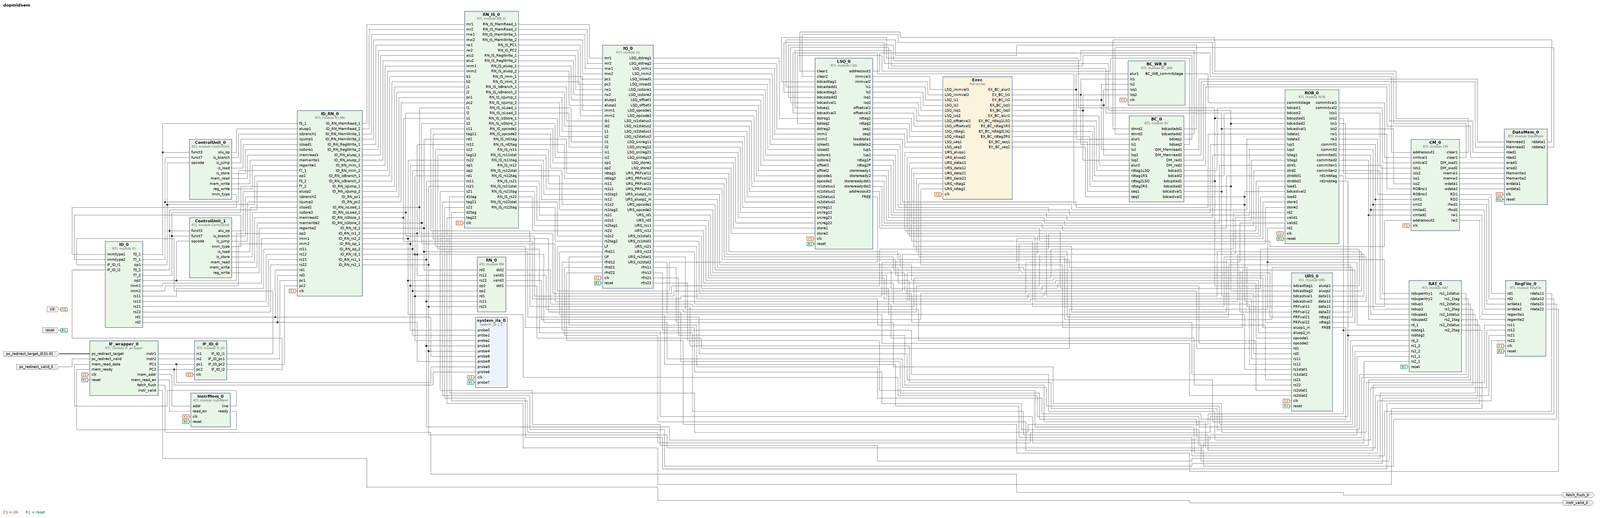
[diagram p0: block diagram of the top level, whole]
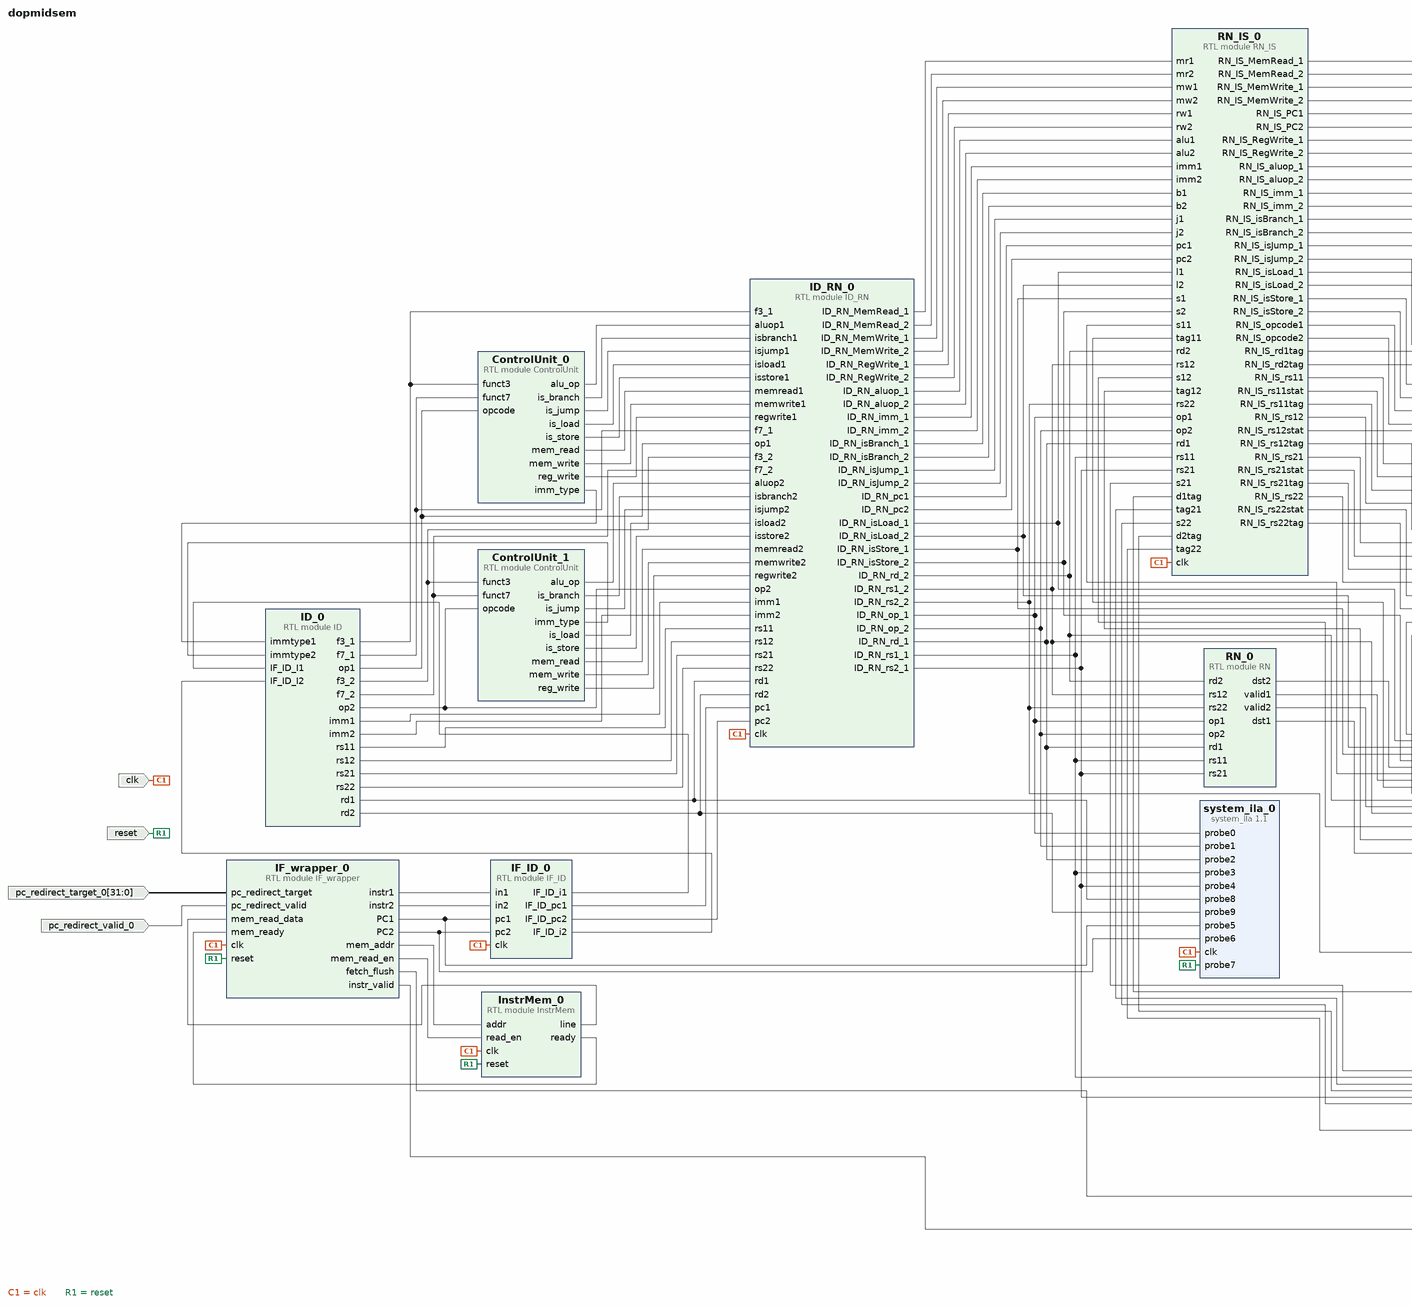
[diagram p1: block diagram of the top level, left part]
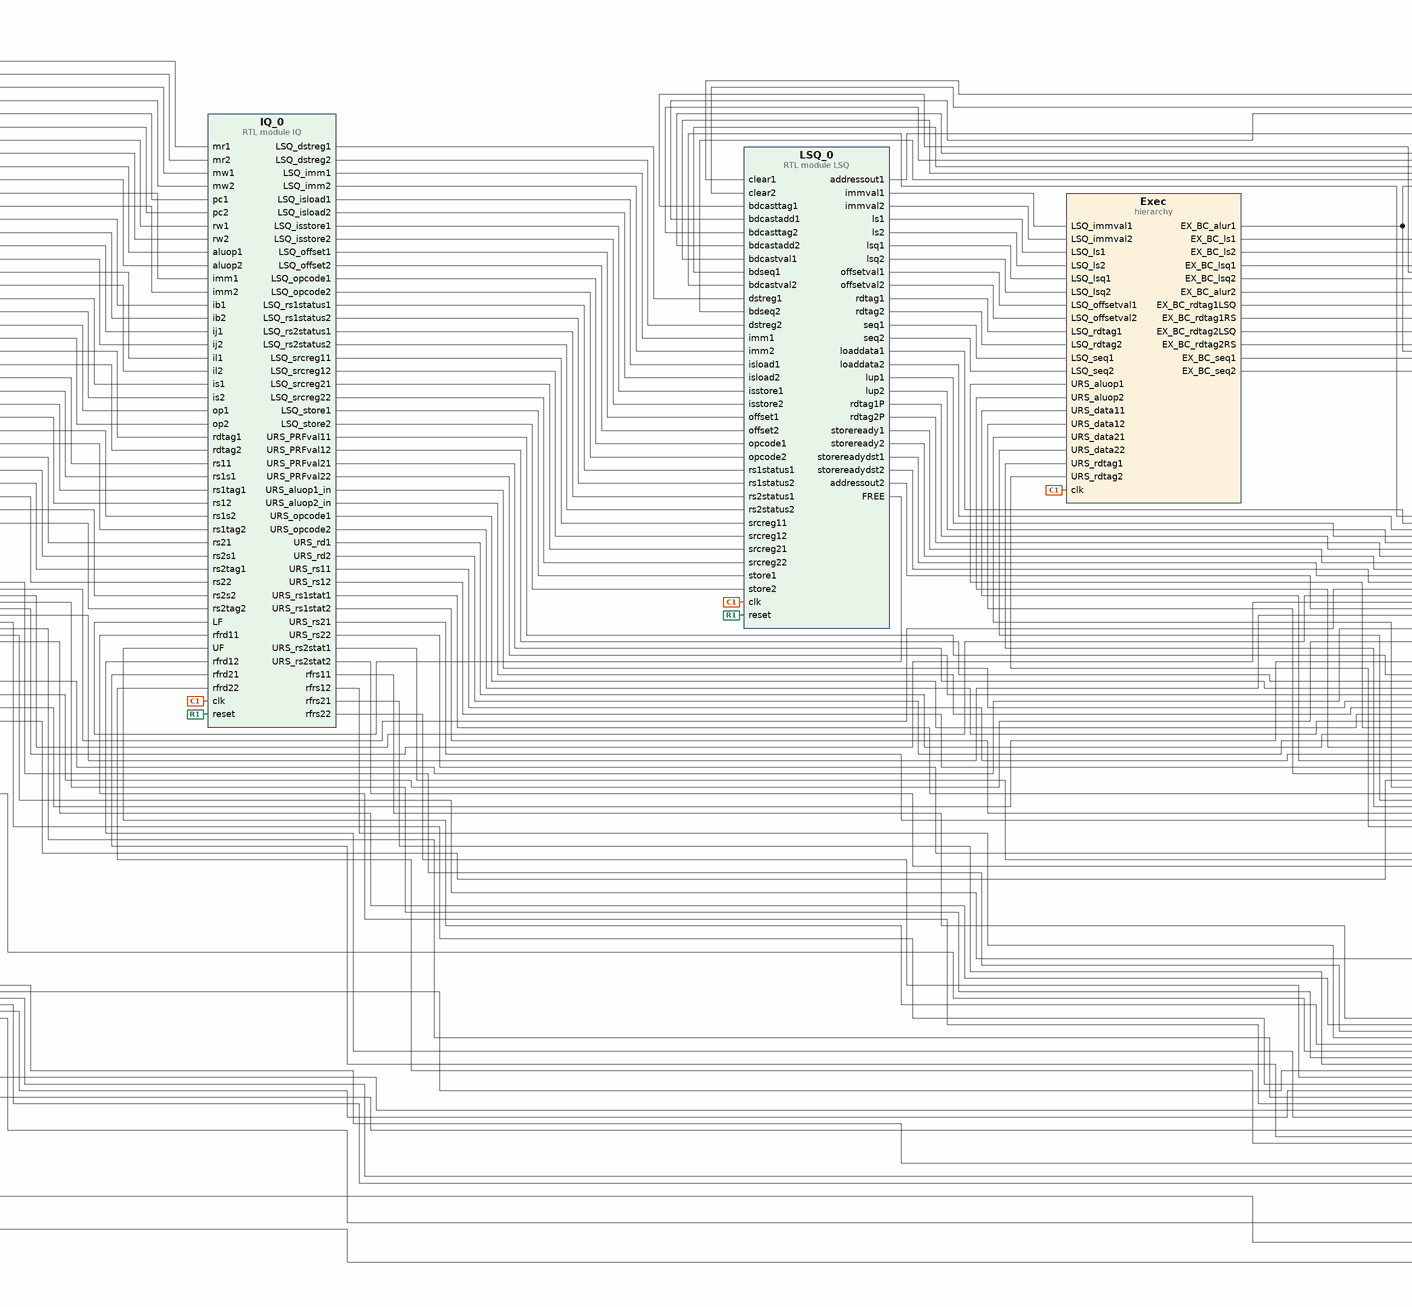
[diagram p2: block diagram of the top level, centre part]
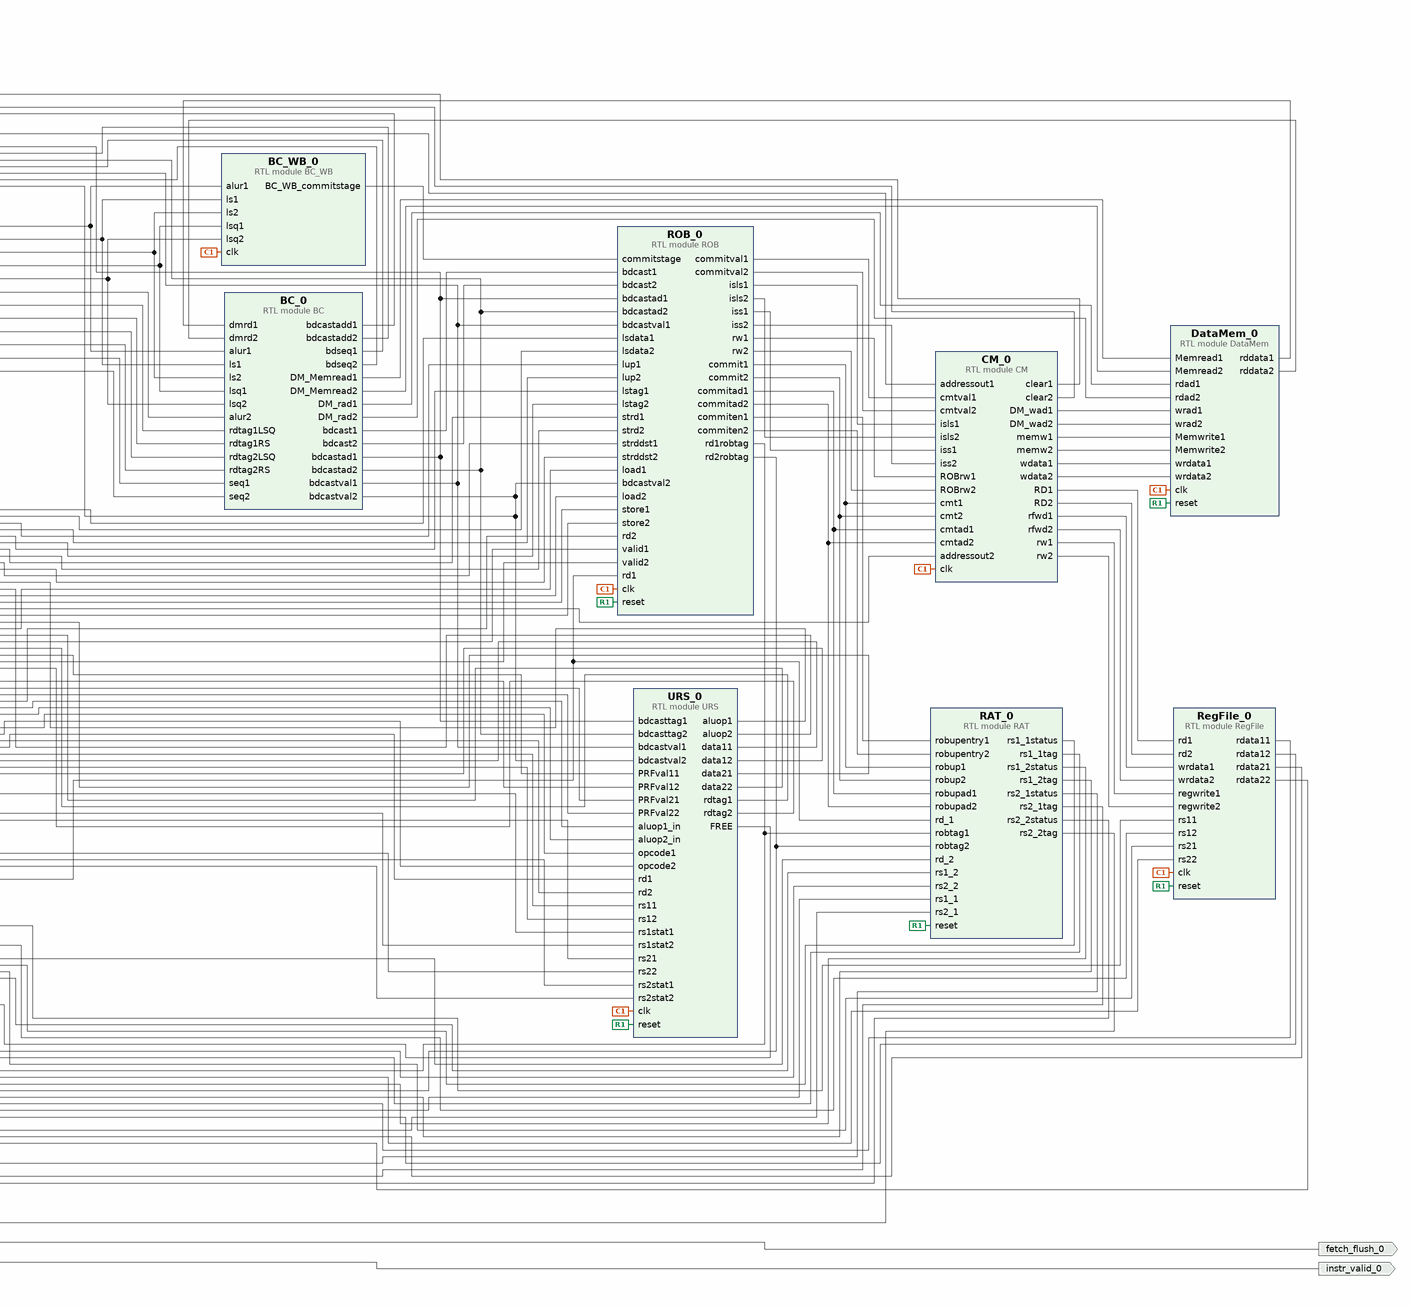
[diagram p3: block diagram of the top level, right part]
# Vivado block design dopmidsem, xc7z020clg484-1, Vivado 2025.1
create_bd_design dopmidsem

create_bd_port -dir I -type clk clk
set_property -dict {CONFIG.FREQ_HZ 100000000} [get_bd_ports clk]
create_bd_port -dir I -type rst reset
set_property -dict {CONFIG.POLARITY ACTIVE_HIGH} [get_bd_ports reset]
create_bd_port -dir O instr_valid_0
create_bd_port -dir O fetch_flush_0
create_bd_port -dir I -from 31 -to 0 pc_redirect_target_0
create_bd_port -dir I pc_redirect_valid_0

create_bd_cell -type module -reference IF_ID IF_ID_0
create_bd_cell -type module -reference ID ID_0
create_bd_cell -type module -reference ControlUnit ControlUnit_0
create_bd_cell -type module -reference ControlUnit ControlUnit_1
create_bd_cell -type module -reference ID_RN ID_RN_0
create_bd_cell -type module -reference ROB ROB_0
create_bd_cell -type module -reference RAT RAT_0
create_bd_cell -type module -reference RN RN_0
create_bd_cell -type module -reference RN_IS RN_IS_0
create_bd_cell -type module -reference IQ IQ_0
create_bd_cell -type module -reference RegFile RegFile_0
create_bd_cell -type module -reference URS URS_0
create_bd_cell -type module -reference LSQ LSQ_0
create_bd_cell -type module -reference BC BC_0
create_bd_cell -type module -reference DataMem DataMem_0
create_bd_cell -type module -reference BC_WB BC_WB_0
create_bd_cell -type module -reference CM CM_0
create_bd_cell -type hier Exec
create_bd_cell -type ip -vlnv xilinx.com:ip:system_ila:1.1 system_ila_0
set_property -dict [list \
  CONFIG.C_MON_TYPE NATIVE \
  CONFIG.C_NUM_OF_PROBES 10 \
  CONFIG.C_PROBE0_TYPE 0 \
  CONFIG.C_PROBE1_TYPE 0 \
  CONFIG.C_PROBE2_TYPE 0 \
  CONFIG.C_PROBE3_TYPE 0 \
  CONFIG.C_PROBE4_TYPE 0 \
  CONFIG.C_PROBE5_TYPE 0 \
  CONFIG.C_PROBE6_TYPE 0 \
] [get_bd_cells system_ila_0]
create_bd_cell -type module -reference IF_wrapper IF_wrapper_0
create_bd_cell -type module -reference InstrMem InstrMem_0

# ---- hierarchy /Exec ----
current_bd_instance /Exec
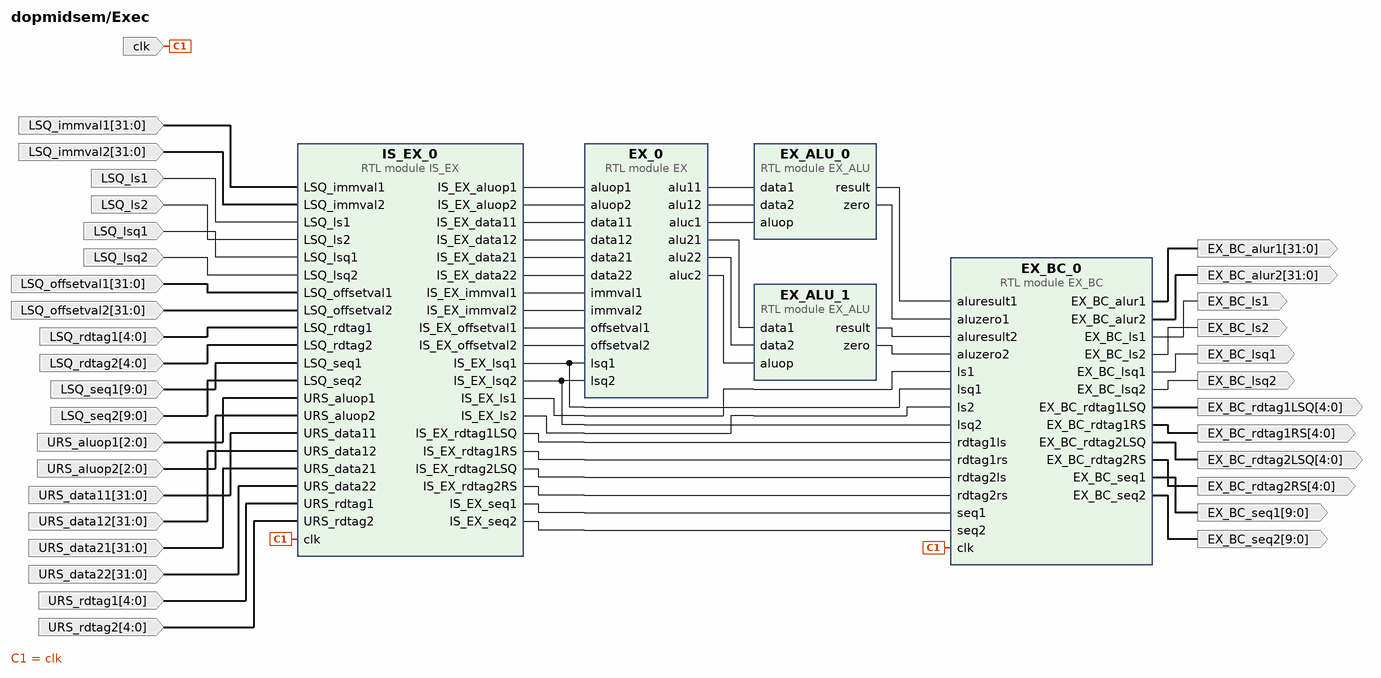
[diagram p4: block diagram inside /Exec]
create_bd_pin -dir I -type clk clk
create_bd_pin -dir O -from 31 -to 0 EX_BC_alur1
create_bd_pin -dir O -from 31 -to 0 EX_BC_alur2
create_bd_pin -dir O -from 4 -to 0 EX_BC_rdtag1LSQ
create_bd_pin -dir O -from 4 -to 0 EX_BC_rdtag2LSQ
create_bd_pin -dir O -from 9 -to 0 EX_BC_seq1
create_bd_pin -dir O -from 9 -to 0 EX_BC_seq2
create_bd_pin -dir O EX_BC_ls1
create_bd_pin -dir O EX_BC_ls2
create_bd_pin -dir O -from 4 -to 0 EX_BC_rdtag1RS
create_bd_pin -dir O -from 4 -to 0 EX_BC_rdtag2RS
create_bd_pin -dir O EX_BC_lsq1
create_bd_pin -dir O EX_BC_lsq2
create_bd_pin -dir I -from 4 -to 0 URS_rdtag2
create_bd_pin -dir I -from 2 -to 0 URS_aluop2
create_bd_pin -dir I -from 31 -to 0 URS_data21
create_bd_pin -dir I -from 4 -to 0 URS_rdtag1
create_bd_pin -dir I -from 2 -to 0 URS_aluop1
create_bd_pin -dir I -from 31 -to 0 URS_data12
create_bd_pin -dir I -from 31 -to 0 URS_data11
create_bd_pin -dir I -from 31 -to 0 URS_data22
create_bd_pin -dir I -from 4 -to 0 LSQ_rdtag1
create_bd_pin -dir I -from 31 -to 0 LSQ_immval2
create_bd_pin -dir I -from 4 -to 0 LSQ_rdtag2
create_bd_pin -dir I -from 9 -to 0 LSQ_seq1
create_bd_pin -dir I -from 31 -to 0 LSQ_offsetval1
create_bd_pin -dir I -from 9 -to 0 LSQ_seq2
create_bd_pin -dir I -from 31 -to 0 LSQ_immval1
create_bd_pin -dir I LSQ_ls2
create_bd_pin -dir I -from 31 -to 0 LSQ_offsetval2
create_bd_pin -dir I LSQ_lsq2
create_bd_pin -dir I LSQ_ls1
create_bd_pin -dir I LSQ_lsq1

create_bd_cell -type module -reference EX EX_0
create_bd_cell -type module -reference EX_ALU EX_ALU_0
create_bd_cell -type module -reference EX_ALU EX_ALU_1
create_bd_cell -type module -reference EX_BC EX_BC_0
create_bd_cell -type module -reference IS_EX IS_EX_0

# ---- connections ----

current_bd_instance /Exec
connect_bd_net [get_bd_pins EX_0/alu11] [get_bd_pins EX_ALU_0/data1]
connect_bd_net [get_bd_pins EX_0/alu12] [get_bd_pins EX_ALU_0/data2]
connect_bd_net [get_bd_pins EX_0/alu21] [get_bd_pins EX_ALU_1/data1]
connect_bd_net [get_bd_pins EX_0/alu22] [get_bd_pins EX_ALU_1/data2]
connect_bd_net [get_bd_pins EX_0/aluc1] [get_bd_pins EX_ALU_0/aluop]
connect_bd_net [get_bd_pins EX_0/aluc2] [get_bd_pins EX_ALU_1/aluop]
connect_bd_net [get_bd_pins EX_ALU_0/result] [get_bd_pins EX_BC_0/aluresult1]
connect_bd_net [get_bd_pins EX_ALU_0/zero] [get_bd_pins EX_BC_0/aluzero1]
connect_bd_net [get_bd_pins EX_ALU_1/result] [get_bd_pins EX_BC_0/aluresult2]
connect_bd_net [get_bd_pins EX_ALU_1/zero] [get_bd_pins EX_BC_0/aluzero2]
connect_bd_net [get_bd_pins EX_BC_0/EX_BC_alur1] [get_bd_pins EX_BC_alur1]
connect_bd_net [get_bd_pins EX_BC_0/EX_BC_alur2] [get_bd_pins EX_BC_alur2]
connect_bd_net [get_bd_pins EX_BC_0/EX_BC_ls1] [get_bd_pins EX_BC_ls1]
connect_bd_net [get_bd_pins EX_BC_0/EX_BC_ls2] [get_bd_pins EX_BC_ls2]
connect_bd_net [get_bd_pins EX_BC_0/EX_BC_lsq1] [get_bd_pins EX_BC_lsq1]
connect_bd_net [get_bd_pins EX_BC_0/EX_BC_lsq2] [get_bd_pins EX_BC_lsq2]
connect_bd_net [get_bd_pins EX_BC_0/EX_BC_rdtag1LSQ] [get_bd_pins EX_BC_rdtag1LSQ]
connect_bd_net [get_bd_pins EX_BC_0/EX_BC_rdtag1RS] [get_bd_pins EX_BC_rdtag1RS]
connect_bd_net [get_bd_pins EX_BC_0/EX_BC_rdtag2LSQ] [get_bd_pins EX_BC_rdtag2LSQ]
connect_bd_net [get_bd_pins EX_BC_0/EX_BC_rdtag2RS] [get_bd_pins EX_BC_rdtag2RS]
connect_bd_net [get_bd_pins EX_BC_0/EX_BC_seq1] [get_bd_pins EX_BC_seq1]
connect_bd_net [get_bd_pins EX_BC_0/EX_BC_seq2] [get_bd_pins EX_BC_seq2]
connect_bd_net [get_bd_pins IS_EX_0/IS_EX_aluop1] [get_bd_pins EX_0/aluop1]
connect_bd_net [get_bd_pins IS_EX_0/IS_EX_aluop2] [get_bd_pins EX_0/aluop2]
connect_bd_net [get_bd_pins IS_EX_0/IS_EX_data11] [get_bd_pins EX_0/data11]
connect_bd_net [get_bd_pins IS_EX_0/IS_EX_data12] [get_bd_pins EX_0/data12]
connect_bd_net [get_bd_pins IS_EX_0/IS_EX_data21] [get_bd_pins EX_0/data21]
connect_bd_net [get_bd_pins IS_EX_0/IS_EX_data22] [get_bd_pins EX_0/data22]
connect_bd_net [get_bd_pins IS_EX_0/IS_EX_immval1] [get_bd_pins EX_0/immval1]
connect_bd_net [get_bd_pins IS_EX_0/IS_EX_immval2] [get_bd_pins EX_0/immval2]
connect_bd_net [get_bd_pins IS_EX_0/IS_EX_ls1] [get_bd_pins EX_BC_0/ls1]
connect_bd_net [get_bd_pins IS_EX_0/IS_EX_ls2] [get_bd_pins EX_BC_0/ls2]
connect_bd_net [get_bd_pins IS_EX_0/IS_EX_lsq1] [get_bd_pins EX_BC_0/lsq1] [get_bd_pins EX_0/lsq1]
connect_bd_net [get_bd_pins IS_EX_0/IS_EX_lsq2] [get_bd_pins EX_BC_0/lsq2] [get_bd_pins EX_0/lsq2]
connect_bd_net [get_bd_pins IS_EX_0/IS_EX_offsetval1] [get_bd_pins EX_0/offsetval1]
connect_bd_net [get_bd_pins IS_EX_0/IS_EX_offsetval2] [get_bd_pins EX_0/offsetval2]
connect_bd_net [get_bd_pins IS_EX_0/IS_EX_rdtag1LSQ] [get_bd_pins EX_BC_0/rdtag1ls]
connect_bd_net [get_bd_pins IS_EX_0/IS_EX_rdtag1RS] [get_bd_pins EX_BC_0/rdtag1rs]
connect_bd_net [get_bd_pins IS_EX_0/IS_EX_rdtag2LSQ] [get_bd_pins EX_BC_0/rdtag2ls]
connect_bd_net [get_bd_pins IS_EX_0/IS_EX_rdtag2RS] [get_bd_pins EX_BC_0/rdtag2rs]
connect_bd_net [get_bd_pins IS_EX_0/IS_EX_seq1] [get_bd_pins EX_BC_0/seq1]
connect_bd_net [get_bd_pins IS_EX_0/IS_EX_seq2] [get_bd_pins EX_BC_0/seq2]
connect_bd_net -net LSQ_immval1_1 [get_bd_pins LSQ_immval1] [get_bd_pins IS_EX_0/LSQ_immval1]
connect_bd_net -net LSQ_immval2_1 [get_bd_pins LSQ_immval2] [get_bd_pins IS_EX_0/LSQ_immval2]
connect_bd_net -net LSQ_ls1_1 [get_bd_pins LSQ_ls1] [get_bd_pins IS_EX_0/LSQ_ls1]
connect_bd_net -net LSQ_ls2_1 [get_bd_pins LSQ_ls2] [get_bd_pins IS_EX_0/LSQ_ls2]
connect_bd_net -net LSQ_lsq1_1 [get_bd_pins LSQ_lsq1] [get_bd_pins IS_EX_0/LSQ_lsq1]
connect_bd_net -net LSQ_lsq2_1 [get_bd_pins LSQ_lsq2] [get_bd_pins IS_EX_0/LSQ_lsq2]
connect_bd_net -net LSQ_offsetval1_1 [get_bd_pins LSQ_offsetval1] [get_bd_pins IS_EX_0/LSQ_offsetval1]
connect_bd_net -net LSQ_offsetval2_1 [get_bd_pins LSQ_offsetval2] [get_bd_pins IS_EX_0/LSQ_offsetval2]
connect_bd_net -net LSQ_rdtag1_1 [get_bd_pins LSQ_rdtag1] [get_bd_pins IS_EX_0/LSQ_rdtag1]
connect_bd_net -net LSQ_rdtag2_1 [get_bd_pins LSQ_rdtag2] [get_bd_pins IS_EX_0/LSQ_rdtag2]
connect_bd_net -net LSQ_seq1_1 [get_bd_pins LSQ_seq1] [get_bd_pins IS_EX_0/LSQ_seq1]
connect_bd_net -net LSQ_seq2_1 [get_bd_pins LSQ_seq2] [get_bd_pins IS_EX_0/LSQ_seq2]
connect_bd_net -net URS_aluop1_1 [get_bd_pins URS_aluop1] [get_bd_pins IS_EX_0/URS_aluop1]
connect_bd_net -net URS_aluop2_1 [get_bd_pins URS_aluop2] [get_bd_pins IS_EX_0/URS_aluop2]
connect_bd_net -net URS_data11_1 [get_bd_pins URS_data11] [get_bd_pins IS_EX_0/URS_data11]
connect_bd_net -net URS_data12_1 [get_bd_pins URS_data12] [get_bd_pins IS_EX_0/URS_data12]
connect_bd_net -net URS_data21_1 [get_bd_pins URS_data21] [get_bd_pins IS_EX_0/URS_data21]
connect_bd_net -net URS_data22_1 [get_bd_pins URS_data22] [get_bd_pins IS_EX_0/URS_data22]
connect_bd_net -net URS_rdtag1_1 [get_bd_pins URS_rdtag1] [get_bd_pins IS_EX_0/URS_rdtag1]
connect_bd_net -net URS_rdtag2_1 [get_bd_pins URS_rdtag2] [get_bd_pins IS_EX_0/URS_rdtag2]
connect_bd_net [get_bd_pins clk] [get_bd_pins IS_EX_0/clk] [get_bd_pins EX_BC_0/clk]

current_bd_instance /
connect_bd_net [get_bd_pins BC_0/DM_Memread1] [get_bd_pins DataMem_0/Memread1]
connect_bd_net [get_bd_pins BC_0/DM_Memread2] [get_bd_pins DataMem_0/Memread2]
connect_bd_net [get_bd_pins BC_0/DM_rad1] [get_bd_pins DataMem_0/rdad1]
connect_bd_net [get_bd_pins BC_0/DM_rad2] [get_bd_pins DataMem_0/rdad2]
connect_bd_net [get_bd_pins BC_0/bdcast1] [get_bd_pins ROB_0/bdcast1]
connect_bd_net [get_bd_pins BC_0/bdcast2] [get_bd_pins ROB_0/bdcast2]
connect_bd_net [get_bd_pins BC_0/bdcastad1] [get_bd_pins URS_0/bdcasttag1] [get_bd_pins LSQ_0/bdcasttag1] [get_bd_pins ROB_0/bdcastad1]
connect_bd_net [get_bd_pins BC_0/bdcastad2] [get_bd_pins URS_0/bdcasttag2] [get_bd_pins LSQ_0/bdcasttag2] [get_bd_pins ROB_0/bdcastad2]
connect_bd_net [get_bd_pins BC_0/bdcastadd1] [get_bd_pins LSQ_0/bdcastadd1]
connect_bd_net [get_bd_pins BC_0/bdcastadd2] [get_bd_pins LSQ_0/bdcastadd2]
connect_bd_net [get_bd_pins BC_0/bdcastval1] [get_bd_pins URS_0/bdcastval1] [get_bd_pins LSQ_0/bdcastval1] [get_bd_pins ROB_0/bdcastval1]
connect_bd_net [get_bd_pins BC_0/bdcastval2] [get_bd_pins URS_0/bdcastval2] [get_bd_pins LSQ_0/bdcastval2] [get_bd_pins ROB_0/bdcastval2]
connect_bd_net [get_bd_pins BC_0/bdseq1] [get_bd_pins LSQ_0/bdseq1]
connect_bd_net [get_bd_pins BC_0/bdseq2] [get_bd_pins LSQ_0/bdseq2]
connect_bd_net [get_bd_pins BC_WB_0/BC_WB_commitstage] [get_bd_pins ROB_0/commitstage]
connect_bd_net [get_bd_pins CM_0/DM_wad1] [get_bd_pins DataMem_0/wrad1]
connect_bd_net [get_bd_pins CM_0/DM_wad2] [get_bd_pins DataMem_0/wrad2]
connect_bd_net [get_bd_pins CM_0/RD1] [get_bd_pins RegFile_0/rd1]
connect_bd_net [get_bd_pins CM_0/RD2] [get_bd_pins RegFile_0/rd2]
connect_bd_net [get_bd_pins CM_0/clear1] [get_bd_pins LSQ_0/clear1]
connect_bd_net [get_bd_pins CM_0/clear2] [get_bd_pins LSQ_0/clear2]
connect_bd_net [get_bd_pins CM_0/memw1] [get_bd_pins DataMem_0/Memwrite1]
connect_bd_net [get_bd_pins CM_0/memw2] [get_bd_pins DataMem_0/Memwrite2]
connect_bd_net [get_bd_pins CM_0/rfwd1] [get_bd_pins RegFile_0/wrdata1]
connect_bd_net [get_bd_pins CM_0/rfwd2] [get_bd_pins RegFile_0/wrdata2]
connect_bd_net [get_bd_pins CM_0/rw1] [get_bd_pins RegFile_0/regwrite1]
connect_bd_net [get_bd_pins CM_0/rw2] [get_bd_pins RegFile_0/regwrite2]
connect_bd_net [get_bd_pins CM_0/wdata1] [get_bd_pins DataMem_0/wrdata1]
connect_bd_net [get_bd_pins CM_0/wdata2] [get_bd_pins DataMem_0/wrdata2]
connect_bd_net [get_bd_pins ControlUnit_0/alu_op] [get_bd_pins ID_RN_0/aluop1]
connect_bd_net [get_bd_pins ControlUnit_0/imm_type] [get_bd_pins ID_0/immtype1]
connect_bd_net [get_bd_pins ControlUnit_0/is_branch] [get_bd_pins ID_RN_0/isbranch1]
connect_bd_net [get_bd_pins ControlUnit_0/is_jump] [get_bd_pins ID_RN_0/isjump1]
connect_bd_net [get_bd_pins ControlUnit_0/is_load] [get_bd_pins ID_RN_0/isload1]
connect_bd_net [get_bd_pins ControlUnit_0/is_store] [get_bd_pins ID_RN_0/isstore1]
connect_bd_net [get_bd_pins ControlUnit_0/mem_read] [get_bd_pins ID_RN_0/memread1]
connect_bd_net [get_bd_pins ControlUnit_0/mem_write] [get_bd_pins ID_RN_0/memwrite1]
connect_bd_net -net ControlUnit_0_reg_write [get_bd_pins ControlUnit_0/reg_write] [get_bd_pins ID_RN_0/regwrite1]
connect_bd_net [get_bd_pins ControlUnit_1/alu_op] [get_bd_pins ID_RN_0/aluop2]
connect_bd_net [get_bd_pins ControlUnit_1/imm_type] [get_bd_pins ID_0/immtype2]
connect_bd_net [get_bd_pins ControlUnit_1/is_branch] [get_bd_pins ID_RN_0/isbranch2]
connect_bd_net [get_bd_pins ControlUnit_1/is_jump] [get_bd_pins ID_RN_0/isjump2]
connect_bd_net [get_bd_pins ControlUnit_1/is_load] [get_bd_pins ID_RN_0/isload2]
connect_bd_net [get_bd_pins ControlUnit_1/is_store] [get_bd_pins ID_RN_0/isstore2]
connect_bd_net -net ControlUnit_1_mem_read [get_bd_pins ControlUnit_1/mem_read] [get_bd_pins ID_RN_0/memread2]
connect_bd_net -net ControlUnit_1_mem_write [get_bd_pins ControlUnit_1/mem_write] [get_bd_pins ID_RN_0/memwrite2]
connect_bd_net -net ControlUnit_1_reg_write [get_bd_pins ControlUnit_1/reg_write] [get_bd_pins ID_RN_0/regwrite2]
connect_bd_net [get_bd_pins DataMem_0/rddata1] [get_bd_pins BC_0/dmrd1]
connect_bd_net [get_bd_pins DataMem_0/rddata2] [get_bd_pins BC_0/dmrd2]
connect_bd_net -net EX_BC_0_EX_BC_alur1 [get_bd_pins Exec/EX_BC_alur1] [get_bd_pins BC_WB_0/alur1] [get_bd_pins BC_0/alur1]
connect_bd_net -net EX_BC_0_EX_BC_alur2 [get_bd_pins Exec/EX_BC_alur2] [get_bd_pins BC_0/alur2]
connect_bd_net -net EX_BC_0_EX_BC_ls1 [get_bd_pins Exec/EX_BC_ls1] [get_bd_pins BC_WB_0/ls1] [get_bd_pins BC_0/ls1]
connect_bd_net -net EX_BC_0_EX_BC_ls2 [get_bd_pins Exec/EX_BC_ls2] [get_bd_pins BC_WB_0/ls2] [get_bd_pins BC_0/ls2]
connect_bd_net -net EX_BC_0_EX_BC_lsq1 [get_bd_pins Exec/EX_BC_lsq1] [get_bd_pins BC_WB_0/lsq1] [get_bd_pins BC_0/lsq1]
connect_bd_net -net EX_BC_0_EX_BC_lsq2 [get_bd_pins Exec/EX_BC_lsq2] [get_bd_pins BC_WB_0/lsq2] [get_bd_pins BC_0/lsq2]
connect_bd_net -net EX_BC_0_EX_BC_rdtag1LSQ [get_bd_pins Exec/EX_BC_rdtag1LSQ] [get_bd_pins BC_0/rdtag1LSQ]
connect_bd_net -net EX_BC_0_EX_BC_rdtag1RS [get_bd_pins Exec/EX_BC_rdtag1RS] [get_bd_pins BC_0/rdtag1RS]
connect_bd_net -net EX_BC_0_EX_BC_rdtag2LSQ [get_bd_pins Exec/EX_BC_rdtag2LSQ] [get_bd_pins BC_0/rdtag2LSQ]
connect_bd_net -net EX_BC_0_EX_BC_rdtag2RS [get_bd_pins Exec/EX_BC_rdtag2RS] [get_bd_pins BC_0/rdtag2RS]
connect_bd_net -net EX_BC_0_EX_BC_seq1 [get_bd_pins Exec/EX_BC_seq1] [get_bd_pins BC_0/seq1]
connect_bd_net -net EX_BC_0_EX_BC_seq2 [get_bd_pins Exec/EX_BC_seq2] [get_bd_pins BC_0/seq2]
connect_bd_net [get_bd_pins ID_0/f3_1] [get_bd_pins ControlUnit_0/funct3] [get_bd_pins ID_RN_0/f3_1]
connect_bd_net [get_bd_pins ID_0/f3_2] [get_bd_pins ControlUnit_1/funct3] [get_bd_pins ID_RN_0/f3_2]
connect_bd_net [get_bd_pins ID_0/f7_1] [get_bd_pins ControlUnit_0/funct7] [get_bd_pins ID_RN_0/f7_1]
connect_bd_net [get_bd_pins ID_0/f7_2] [get_bd_pins ControlUnit_1/funct7] [get_bd_pins ID_RN_0/f7_2]
connect_bd_net [get_bd_pins ID_0/imm1] [get_bd_pins ID_RN_0/imm1]
connect_bd_net [get_bd_pins ID_0/imm2] [get_bd_pins ID_RN_0/imm2]
connect_bd_net [get_bd_pins ID_0/op1] [get_bd_pins ControlUnit_0/opcode] [get_bd_pins ID_RN_0/op1]
connect_bd_net [get_bd_pins ID_0/op2] [get_bd_pins ControlUnit_1/opcode] [get_bd_pins ID_RN_0/op2]
connect_bd_net -net ID_0_rd1 [get_bd_pins ID_0/rd1] [get_bd_pins system_ila_0/probe8] [get_bd_pins ID_RN_0/rd1]
connect_bd_net -net ID_0_rd2 [get_bd_pins ID_0/rd2] [get_bd_pins system_ila_0/probe9] [get_bd_pins ID_RN_0/rd2]
connect_bd_net -net ID_0_rs11 [get_bd_pins ID_0/rs11] [get_bd_pins ID_RN_0/rs11]
connect_bd_net -net ID_0_rs12 [get_bd_pins ID_0/rs12] [get_bd_pins ID_RN_0/rs12]
connect_bd_net -net ID_0_rs21 [get_bd_pins ID_0/rs21] [get_bd_pins ID_RN_0/rs21]
connect_bd_net -net ID_0_rs22 [get_bd_pins ID_0/rs22] [get_bd_pins ID_RN_0/rs22]
connect_bd_net [get_bd_pins ID_RN_0/ID_RN_MemRead_1] [get_bd_pins RN_IS_0/mr1]
connect_bd_net [get_bd_pins ID_RN_0/ID_RN_MemRead_2] [get_bd_pins RN_IS_0/mr2]
connect_bd_net [get_bd_pins ID_RN_0/ID_RN_MemWrite_1] [get_bd_pins RN_IS_0/mw1]
connect_bd_net [get_bd_pins ID_RN_0/ID_RN_MemWrite_2] [get_bd_pins RN_IS_0/mw2]
connect_bd_net [get_bd_pins ID_RN_0/ID_RN_RegWrite_1] [get_bd_pins RN_IS_0/rw1]
connect_bd_net [get_bd_pins ID_RN_0/ID_RN_RegWrite_2] [get_bd_pins RN_IS_0/rw2]
connect_bd_net [get_bd_pins ID_RN_0/ID_RN_aluop_1] [get_bd_pins RN_IS_0/alu1]
connect_bd_net [get_bd_pins ID_RN_0/ID_RN_aluop_2] [get_bd_pins RN_IS_0/alu2]
connect_bd_net [get_bd_pins ID_RN_0/ID_RN_imm_1] [get_bd_pins RN_IS_0/imm1]
connect_bd_net [get_bd_pins ID_RN_0/ID_RN_imm_2] [get_bd_pins RN_IS_0/imm2]
connect_bd_net [get_bd_pins ID_RN_0/ID_RN_isBranch_1] [get_bd_pins RN_IS_0/b1]
connect_bd_net [get_bd_pins ID_RN_0/ID_RN_isBranch_2] [get_bd_pins RN_IS_0/b2]
connect_bd_net [get_bd_pins ID_RN_0/ID_RN_isJump_1] [get_bd_pins RN_IS_0/j1]
connect_bd_net [get_bd_pins ID_RN_0/ID_RN_isJump_2] [get_bd_pins RN_IS_0/j2]
connect_bd_net [get_bd_pins ID_RN_0/ID_RN_isLoad_1] [get_bd_pins RN_IS_0/l1] [get_bd_pins ROB_0/load1]
connect_bd_net [get_bd_pins ID_RN_0/ID_RN_isLoad_2] [get_bd_pins RN_IS_0/l2] [get_bd_pins ROB_0/load2]
connect_bd_net [get_bd_pins ID_RN_0/ID_RN_isStore_1] [get_bd_pins RN_IS_0/s1] [get_bd_pins ROB_0/store1]
connect_bd_net [get_bd_pins ID_RN_0/ID_RN_isStore_2] [get_bd_pins RN_IS_0/s2] [get_bd_pins ROB_0/store2]
connect_bd_net -net ID_RN_0_ID_RN_op_1 [get_bd_pins ID_RN_0/ID_RN_op_1] \
  [get_bd_pins system_ila_0/probe0] [get_bd_pins RN_0/op1] [get_bd_pins RN_IS_0/op1]
connect_bd_net -net ID_RN_0_ID_RN_op_2 [get_bd_pins ID_RN_0/ID_RN_op_2] \
  [get_bd_pins system_ila_0/probe1] [get_bd_pins RN_0/op2] [get_bd_pins RN_IS_0/op2]
connect_bd_net [get_bd_pins ID_RN_0/ID_RN_pc1] [get_bd_pins RN_IS_0/pc1]
connect_bd_net [get_bd_pins ID_RN_0/ID_RN_pc2] [get_bd_pins RN_IS_0/pc2]
connect_bd_net -net ID_RN_0_ID_RN_rd_1 [get_bd_pins ID_RN_0/ID_RN_rd_1] \
  [get_bd_pins system_ila_0/probe2] [get_bd_pins RN_0/rd1] [get_bd_pins RN_IS_0/rd1]
connect_bd_net [get_bd_pins ID_RN_0/ID_RN_rd_2] [get_bd_pins RN_0/rd2] [get_bd_pins RN_IS_0/rd2] [get_bd_pins RAT_0/rd_2]
connect_bd_net -net ID_RN_0_ID_RN_rs1_1 [get_bd_pins ID_RN_0/ID_RN_rs1_1] \
  [get_bd_pins system_ila_0/probe3] [get_bd_pins RN_0/rs11] [get_bd_pins RN_IS_0/rs11] [get_bd_pins RAT_0/rs1_1]
connect_bd_net [get_bd_pins ID_RN_0/ID_RN_rs1_2] [get_bd_pins RN_0/rs12] [get_bd_pins RN_IS_0/rs12] [get_bd_pins RAT_0/rs1_2]
connect_bd_net -net ID_RN_0_ID_RN_rs2_1 [get_bd_pins ID_RN_0/ID_RN_rs2_1] \
  [get_bd_pins system_ila_0/probe4] [get_bd_pins RN_0/rs21] [get_bd_pins RN_IS_0/rs21] [get_bd_pins RAT_0/rs2_1]
connect_bd_net [get_bd_pins ID_RN_0/ID_RN_rs2_2] [get_bd_pins RN_0/rs22] [get_bd_pins RN_IS_0/rs22] [get_bd_pins RAT_0/rs2_2]
connect_bd_net -net IF_0_PC1 [get_bd_pins IF_wrapper_0/PC1] [get_bd_pins system_ila_0/probe5] [get_bd_pins IF_ID_0/pc1]
connect_bd_net -net IF_0_PC2 [get_bd_pins IF_wrapper_0/PC2] [get_bd_pins system_ila_0/probe6] [get_bd_pins IF_ID_0/pc2]
connect_bd_net [get_bd_pins IF_ID_0/IF_ID_i1] [get_bd_pins ID_0/IF_ID_I1]
connect_bd_net [get_bd_pins IF_ID_0/IF_ID_i2] [get_bd_pins ID_0/IF_ID_I2]
connect_bd_net [get_bd_pins IF_ID_0/IF_ID_pc1] [get_bd_pins ID_RN_0/pc1]
connect_bd_net [get_bd_pins IF_ID_0/IF_ID_pc2] [get_bd_pins ID_RN_0/pc2]
connect_bd_net [get_bd_pins IF_wrapper_0/fetch_flush] [get_bd_ports fetch_flush_0]
connect_bd_net [get_bd_pins IF_wrapper_0/instr1] [get_bd_pins IF_ID_0/in1]
connect_bd_net [get_bd_pins IF_wrapper_0/instr2] [get_bd_pins IF_ID_0/in2]
connect_bd_net [get_bd_pins IF_wrapper_0/instr_valid] [get_bd_ports instr_valid_0]
connect_bd_net [get_bd_pins IF_wrapper_0/mem_addr] [get_bd_pins InstrMem_0/addr]
connect_bd_net [get_bd_pins IF_wrapper_0/mem_read_en] [get_bd_pins InstrMem_0/read_en]
connect_bd_net [get_bd_pins IQ_0/LSQ_dstreg1] [get_bd_pins LSQ_0/dstreg1]
connect_bd_net [get_bd_pins IQ_0/LSQ_dstreg2] [get_bd_pins LSQ_0/dstreg2]
connect_bd_net [get_bd_pins IQ_0/LSQ_imm1] [get_bd_pins LSQ_0/imm1]
connect_bd_net [get_bd_pins IQ_0/LSQ_imm2] [get_bd_pins LSQ_0/imm2]
connect_bd_net [get_bd_pins IQ_0/LSQ_isload1] [get_bd_pins LSQ_0/isload1]
connect_bd_net [get_bd_pins IQ_0/LSQ_isload2] [get_bd_pins LSQ_0/isload2]
connect_bd_net [get_bd_pins IQ_0/LSQ_isstore1] [get_bd_pins LSQ_0/isstore1]
connect_bd_net [get_bd_pins IQ_0/LSQ_isstore2] [get_bd_pins LSQ_0/isstore2]
connect_bd_net [get_bd_pins IQ_0/LSQ_offset1] [get_bd_pins LSQ_0/offset1]
connect_bd_net [get_bd_pins IQ_0/LSQ_offset2] [get_bd_pins LSQ_0/offset2]
connect_bd_net [get_bd_pins IQ_0/LSQ_opcode1] [get_bd_pins LSQ_0/opcode1]
connect_bd_net [get_bd_pins IQ_0/LSQ_opcode2] [get_bd_pins LSQ_0/opcode2]
connect_bd_net [get_bd_pins IQ_0/LSQ_rs1status1] [get_bd_pins LSQ_0/rs1status1]
connect_bd_net [get_bd_pins IQ_0/LSQ_rs1status2] [get_bd_pins LSQ_0/rs1status2]
connect_bd_net [get_bd_pins IQ_0/LSQ_rs2status1] [get_bd_pins LSQ_0/rs2status1]
connect_bd_net [get_bd_pins IQ_0/LSQ_rs2status2] [get_bd_pins LSQ_0/rs2status2]
connect_bd_net [get_bd_pins IQ_0/LSQ_srcreg11] [get_bd_pins LSQ_0/srcreg11]
connect_bd_net [get_bd_pins IQ_0/LSQ_srcreg12] [get_bd_pins LSQ_0/srcreg12]
connect_bd_net [get_bd_pins IQ_0/LSQ_srcreg21] [get_bd_pins LSQ_0/srcreg21]
connect_bd_net [get_bd_pins IQ_0/LSQ_srcreg22] [get_bd_pins LSQ_0/srcreg22]
connect_bd_net [get_bd_pins IQ_0/LSQ_store1] [get_bd_pins LSQ_0/store1]
connect_bd_net [get_bd_pins IQ_0/LSQ_store2] [get_bd_pins LSQ_0/store2]
connect_bd_net [get_bd_pins IQ_0/URS_PRFval11] [get_bd_pins URS_0/PRFval11]
connect_bd_net [get_bd_pins IQ_0/URS_PRFval12] [get_bd_pins URS_0/PRFval12]
connect_bd_net [get_bd_pins IQ_0/URS_PRFval21] [get_bd_pins URS_0/PRFval21]
connect_bd_net [get_bd_pins IQ_0/URS_PRFval22] [get_bd_pins URS_0/PRFval22]
connect_bd_net [get_bd_pins IQ_0/URS_aluop1_in] [get_bd_pins URS_0/aluop1_in]
connect_bd_net [get_bd_pins IQ_0/URS_aluop2_in] [get_bd_pins URS_0/aluop2_in]
connect_bd_net [get_bd_pins IQ_0/URS_opcode1] [get_bd_pins URS_0/opcode1]
connect_bd_net [get_bd_pins IQ_0/URS_opcode2] [get_bd_pins URS_0/opcode2]
connect_bd_net [get_bd_pins IQ_0/URS_rd1] [get_bd_pins URS_0/rd1]
connect_bd_net [get_bd_pins IQ_0/URS_rd2] [get_bd_pins URS_0/rd2]
connect_bd_net [get_bd_pins IQ_0/URS_rs11] [get_bd_pins URS_0/rs11]
connect_bd_net [get_bd_pins IQ_0/URS_rs12] [get_bd_pins URS_0/rs12]
connect_bd_net [get_bd_pins IQ_0/URS_rs1stat1] [get_bd_pins URS_0/rs1stat1]
connect_bd_net [get_bd_pins IQ_0/URS_rs1stat2] [get_bd_pins URS_0/rs1stat2]
connect_bd_net [get_bd_pins IQ_0/URS_rs21] [get_bd_pins URS_0/rs21]
connect_bd_net [get_bd_pins IQ_0/URS_rs22] [get_bd_pins URS_0/rs22]
connect_bd_net [get_bd_pins IQ_0/URS_rs2stat1] [get_bd_pins URS_0/rs2stat1]
connect_bd_net [get_bd_pins IQ_0/URS_rs2stat2] [get_bd_pins URS_0/rs2stat2]
connect_bd_net [get_bd_pins IQ_0/rfrs11] [get_bd_pins RegFile_0/rs11]
connect_bd_net [get_bd_pins IQ_0/rfrs12] [get_bd_pins RegFile_0/rs12]
connect_bd_net [get_bd_pins IQ_0/rfrs21] [get_bd_pins RegFile_0/rs21]
connect_bd_net [get_bd_pins IQ_0/rfrs22] [get_bd_pins RegFile_0/rs22]
connect_bd_net [get_bd_pins InstrMem_0/line] [get_bd_pins IF_wrapper_0/mem_read_data]
connect_bd_net [get_bd_pins InstrMem_0/ready] [get_bd_pins IF_wrapper_0/mem_ready]
connect_bd_net [get_bd_pins LSQ_0/FREE] [get_bd_pins IQ_0/LF]
connect_bd_net [get_bd_pins LSQ_0/addressout1] [get_bd_pins CM_0/addressout1]
connect_bd_net [get_bd_pins LSQ_0/addressout2] [get_bd_pins CM_0/addressout2]
connect_bd_net [get_bd_pins LSQ_0/immval1] [get_bd_pins Exec/LSQ_immval1]
connect_bd_net [get_bd_pins LSQ_0/immval2] [get_bd_pins Exec/LSQ_immval2]
connect_bd_net [get_bd_pins LSQ_0/loaddata1] [get_bd_pins ROB_0/lsdata1]
connect_bd_net [get_bd_pins LSQ_0/loaddata2] [get_bd_pins ROB_0/lsdata2]
connect_bd_net [get_bd_pins LSQ_0/ls1] [get_bd_pins Exec/LSQ_ls1]
connect_bd_net [get_bd_pins LSQ_0/ls2] [get_bd_pins Exec/LSQ_ls2]
connect_bd_net [get_bd_pins LSQ_0/lsq1] [get_bd_pins Exec/LSQ_lsq1]
connect_bd_net [get_bd_pins LSQ_0/lsq2] [get_bd_pins Exec/LSQ_lsq2]
connect_bd_net [get_bd_pins LSQ_0/lup1] [get_bd_pins ROB_0/lup1]
connect_bd_net [get_bd_pins LSQ_0/lup2] [get_bd_pins ROB_0/lup2]
connect_bd_net [get_bd_pins LSQ_0/offsetval1] [get_bd_pins Exec/LSQ_offsetval1]
connect_bd_net [get_bd_pins LSQ_0/offsetval2] [get_bd_pins Exec/LSQ_offsetval2]
connect_bd_net [get_bd_pins LSQ_0/rdtag1] [get_bd_pins Exec/LSQ_rdtag1]
connect_bd_net [get_bd_pins LSQ_0/rdtag1P] [get_bd_pins ROB_0/lstag1]
connect_bd_net [get_bd_pins LSQ_0/rdtag2] [get_bd_pins Exec/LSQ_rdtag2]
connect_bd_net [get_bd_pins LSQ_0/rdtag2P] [get_bd_pins ROB_0/lstag2]
connect_bd_net [get_bd_pins LSQ_0/seq1] [get_bd_pins Exec/LSQ_seq1]
connect_bd_net [get_bd_pins LSQ_0/seq2] [get_bd_pins Exec/LSQ_seq2]
connect_bd_net [get_bd_pins LSQ_0/storeready1] [get_bd_pins ROB_0/strd1]
connect_bd_net [get_bd_pins LSQ_0/storeready2] [get_bd_pins ROB_0/strd2]
connect_bd_net [get_bd_pins LSQ_0/storereadydst1] [get_bd_pins ROB_0/strddst1]
connect_bd_net [get_bd_pins LSQ_0/storereadydst2] [get_bd_pins ROB_0/strddst2]
connect_bd_net [get_bd_pins RAT_0/rs1_1status] [get_bd_pins RN_IS_0/s11]
connect_bd_net [get_bd_pins RAT_0/rs1_1tag] [get_bd_pins RN_IS_0/tag11]
connect_bd_net [get_bd_pins RAT_0/rs1_2status] [get_bd_pins RN_IS_0/s12]
connect_bd_net [get_bd_pins RAT_0/rs1_2tag] [get_bd_pins RN_IS_0/tag12]
connect_bd_net [get_bd_pins RAT_0/rs2_1status] [get_bd_pins RN_IS_0/s21]
connect_bd_net [get_bd_pins RAT_0/rs2_1tag] [get_bd_pins RN_IS_0/tag21]
connect_bd_net [get_bd_pins RAT_0/rs2_2status] [get_bd_pins RN_IS_0/s22]
connect_bd_net [get_bd_pins RAT_0/rs2_2tag] [get_bd_pins RN_IS_0/tag22]
connect_bd_net [get_bd_pins RN_0/dst1] [get_bd_pins RAT_0/rd_1] [get_bd_pins ROB_0/rd1]
connect_bd_net [get_bd_pins RN_0/dst2] [get_bd_pins ROB_0/rd2]
connect_bd_net [get_bd_pins RN_0/valid1] [get_bd_pins ROB_0/valid1]
connect_bd_net [get_bd_pins RN_0/valid2] [get_bd_pins ROB_0/valid2]
connect_bd_net [get_bd_pins RN_IS_0/RN_IS_MemRead_1] [get_bd_pins IQ_0/mr1]
connect_bd_net [get_bd_pins RN_IS_0/RN_IS_MemRead_2] [get_bd_pins IQ_0/mr2]
connect_bd_net [get_bd_pins RN_IS_0/RN_IS_MemWrite_1] [get_bd_pins IQ_0/mw1]
connect_bd_net [get_bd_pins RN_IS_0/RN_IS_MemWrite_2] [get_bd_pins IQ_0/mw2]
connect_bd_net [get_bd_pins RN_IS_0/RN_IS_PC1] [get_bd_pins IQ_0/pc1]
connect_bd_net [get_bd_pins RN_IS_0/RN_IS_PC2] [get_bd_pins IQ_0/pc2]
connect_bd_net [get_bd_pins RN_IS_0/RN_IS_RegWrite_1] [get_bd_pins IQ_0/rw1]
connect_bd_net [get_bd_pins RN_IS_0/RN_IS_RegWrite_2] [get_bd_pins IQ_0/rw2]
connect_bd_net [get_bd_pins RN_IS_0/RN_IS_aluop_1] [get_bd_pins IQ_0/aluop1]
connect_bd_net [get_bd_pins RN_IS_0/RN_IS_aluop_2] [get_bd_pins IQ_0/aluop2]
connect_bd_net [get_bd_pins RN_IS_0/RN_IS_imm_1] [get_bd_pins IQ_0/imm1]
connect_bd_net [get_bd_pins RN_IS_0/RN_IS_imm_2] [get_bd_pins IQ_0/imm2]
connect_bd_net [get_bd_pins RN_IS_0/RN_IS_isBranch_1] [get_bd_pins IQ_0/ib1]
connect_bd_net [get_bd_pins RN_IS_0/RN_IS_isBranch_2] [get_bd_pins IQ_0/ib2]
connect_bd_net [get_bd_pins RN_IS_0/RN_IS_isJump_1] [get_bd_pins IQ_0/ij1]
connect_bd_net [get_bd_pins RN_IS_0/RN_IS_isJump_2] [get_bd_pins IQ_0/ij2]
connect_bd_net [get_bd_pins RN_IS_0/RN_IS_isLoad_1] [get_bd_pins IQ_0/il1]
connect_bd_net [get_bd_pins RN_IS_0/RN_IS_isLoad_2] [get_bd_pins IQ_0/il2]
connect_bd_net [get_bd_pins RN_IS_0/RN_IS_isStore_1] [get_bd_pins IQ_0/is1]
connect_bd_net [get_bd_pins RN_IS_0/RN_IS_isStore_2] [get_bd_pins IQ_0/is2]
connect_bd_net [get_bd_pins RN_IS_0/RN_IS_opcode1] [get_bd_pins IQ_0/op1]
connect_bd_net [get_bd_pins RN_IS_0/RN_IS_opcode2] [get_bd_pins IQ_0/op2]
connect_bd_net [get_bd_pins RN_IS_0/RN_IS_rd1tag] [get_bd_pins IQ_0/rdtag1]
connect_bd_net [get_bd_pins RN_IS_0/RN_IS_rd2tag] [get_bd_pins IQ_0/rdtag2]
connect_bd_net [get_bd_pins RN_IS_0/RN_IS_rs11] [get_bd_pins IQ_0/rs11]
connect_bd_net [get_bd_pins RN_IS_0/RN_IS_rs11stat] [get_bd_pins IQ_0/rs1s1]
connect_bd_net [get_bd_pins RN_IS_0/RN_IS_rs11tag] [get_bd_pins IQ_0/rs1tag1]
connect_bd_net [get_bd_pins RN_IS_0/RN_IS_rs12] [get_bd_pins IQ_0/rs12]
connect_bd_net [get_bd_pins RN_IS_0/RN_IS_rs12stat] [get_bd_pins IQ_0/rs1s2]
connect_bd_net [get_bd_pins RN_IS_0/RN_IS_rs12tag] [get_bd_pins IQ_0/rs1tag2]
connect_bd_net [get_bd_pins RN_IS_0/RN_IS_rs21] [get_bd_pins IQ_0/rs21]
connect_bd_net [get_bd_pins RN_IS_0/RN_IS_rs21stat] [get_bd_pins IQ_0/rs2s1]
connect_bd_net [get_bd_pins RN_IS_0/RN_IS_rs21tag] [get_bd_pins IQ_0/rs2tag1]
connect_bd_net [get_bd_pins RN_IS_0/RN_IS_rs22] [get_bd_pins IQ_0/rs22]
connect_bd_net [get_bd_pins RN_IS_0/RN_IS_rs22stat] [get_bd_pins IQ_0/rs2s2]
connect_bd_net [get_bd_pins RN_IS_0/RN_IS_rs22tag] [get_bd_pins IQ_0/rs2tag2]
connect_bd_net [get_bd_pins ROB_0/commit1] [get_bd_pins CM_0/cmt1] [get_bd_pins RAT_0/robup1]
connect_bd_net [get_bd_pins ROB_0/commit2] [get_bd_pins CM_0/cmt2] [get_bd_pins RAT_0/robup2]
connect_bd_net [get_bd_pins ROB_0/commitad1] [get_bd_pins CM_0/cmtad1] [get_bd_pins RAT_0/robupad1]
connect_bd_net [get_bd_pins ROB_0/commitad2] [get_bd_pins CM_0/cmtad2] [get_bd_pins RAT_0/robupad2]
connect_bd_net [get_bd_pins ROB_0/commiten1] [get_bd_pins RAT_0/robupentry1]
connect_bd_net [get_bd_pins ROB_0/commiten2] [get_bd_pins RAT_0/robupentry2]
connect_bd_net [get_bd_pins ROB_0/commitval1] [get_bd_pins CM_0/cmtval1]
connect_bd_net [get_bd_pins ROB_0/commitval2] [get_bd_pins CM_0/cmtval2]
connect_bd_net [get_bd_pins ROB_0/isls1] [get_bd_pins CM_0/isls1]
connect_bd_net [get_bd_pins ROB_0/isls2] [get_bd_pins CM_0/isls2]
connect_bd_net [get_bd_pins ROB_0/iss1] [get_bd_pins CM_0/iss1]
connect_bd_net [get_bd_pins ROB_0/iss2] [get_bd_pins CM_0/iss2]
connect_bd_net [get_bd_pins ROB_0/rd1robtag] [get_bd_pins RN_IS_0/d1tag] [get_bd_pins RAT_0/robtag1]
connect_bd_net [get_bd_pins ROB_0/rd2robtag] [get_bd_pins RN_IS_0/d2tag] [get_bd_pins RAT_0/robtag2]
connect_bd_net [get_bd_pins ROB_0/rw1] [get_bd_pins CM_0/ROBrw1]
connect_bd_net [get_bd_pins ROB_0/rw2] [get_bd_pins CM_0/ROBrw2]
connect_bd_net [get_bd_pins RegFile_0/rdata11] [get_bd_pins IQ_0/rfrd11]
connect_bd_net [get_bd_pins RegFile_0/rdata12] [get_bd_pins IQ_0/rfrd12]
connect_bd_net [get_bd_pins RegFile_0/rdata21] [get_bd_pins IQ_0/rfrd21]
connect_bd_net [get_bd_pins RegFile_0/rdata22] [get_bd_pins IQ_0/rfrd22]
connect_bd_net [get_bd_pins URS_0/FREE] [get_bd_pins IQ_0/UF]
connect_bd_net [get_bd_pins URS_0/aluop1] [get_bd_pins Exec/URS_aluop1]
connect_bd_net [get_bd_pins URS_0/aluop2] [get_bd_pins Exec/URS_aluop2]
connect_bd_net [get_bd_pins URS_0/data11] [get_bd_pins Exec/URS_data11]
connect_bd_net [get_bd_pins URS_0/data12] [get_bd_pins Exec/URS_data12]
connect_bd_net [get_bd_pins URS_0/data21] [get_bd_pins Exec/URS_data21]
connect_bd_net [get_bd_pins URS_0/data22] [get_bd_pins Exec/URS_data22]
connect_bd_net [get_bd_pins URS_0/rdtag1] [get_bd_pins Exec/URS_rdtag1]
connect_bd_net [get_bd_pins URS_0/rdtag2] [get_bd_pins Exec/URS_rdtag2]
connect_bd_net [get_bd_ports clk] \
  [get_bd_pins Exec/clk] [get_bd_pins system_ila_0/clk] [get_bd_pins InstrMem_0/clk] [get_bd_pins BC_WB_0/clk] \
  [get_bd_pins DataMem_0/clk] [get_bd_pins RegFile_0/clk] [get_bd_pins CM_0/clk] [get_bd_pins IF_ID_0/clk] \
  [get_bd_pins RN_IS_0/clk] [get_bd_pins ID_RN_0/clk] [get_bd_pins IF_wrapper_0/clk] [get_bd_pins URS_0/clk] \
  [get_bd_pins IQ_0/clk] [get_bd_pins LSQ_0/clk] [get_bd_pins ROB_0/clk]
connect_bd_net -net pc_redirect_target_0_1 [get_bd_ports pc_redirect_target_0] [get_bd_pins IF_wrapper_0/pc_redirect_target]
connect_bd_net -net pc_redirect_valid_0_1 [get_bd_ports pc_redirect_valid_0] [get_bd_pins IF_wrapper_0/pc_redirect_valid]
connect_bd_net [get_bd_ports reset] \
  [get_bd_pins system_ila_0/probe7] [get_bd_pins InstrMem_0/reset] [get_bd_pins DataMem_0/reset] \
  [get_bd_pins RegFile_0/reset] [get_bd_pins IF_wrapper_0/reset] [get_bd_pins URS_0/reset] [get_bd_pins RAT_0/reset] \
  [get_bd_pins IQ_0/reset] [get_bd_pins LSQ_0/reset] [get_bd_pins ROB_0/reset]
set_property HDL_ATTRIBUTE.DEBUG true [get_bd_nets ControlUnit_0_reg_write]
set_property HDL_ATTRIBUTE.MARK_DEBUG true [get_bd_nets ControlUnit_0_reg_write]
set_property HDL_ATTRIBUTE.DEBUG true [get_bd_nets ControlUnit_1_mem_read]
set_property HDL_ATTRIBUTE.MARK_DEBUG true [get_bd_nets ControlUnit_1_mem_read]
set_property HDL_ATTRIBUTE.DEBUG true [get_bd_nets ControlUnit_1_mem_write]
set_property HDL_ATTRIBUTE.MARK_DEBUG true [get_bd_nets ControlUnit_1_mem_write]
set_property HDL_ATTRIBUTE.DEBUG true [get_bd_nets ControlUnit_1_reg_write]
set_property HDL_ATTRIBUTE.MARK_DEBUG true [get_bd_nets ControlUnit_1_reg_write]
set_property HDL_ATTRIBUTE.DEBUG true [get_bd_nets ID_0_rd1]
set_property HDL_ATTRIBUTE.MARK_DEBUG true [get_bd_nets ID_0_rd1]
set_property HDL_ATTRIBUTE.DEBUG true [get_bd_nets ID_0_rd2]
set_property HDL_ATTRIBUTE.MARK_DEBUG true [get_bd_nets ID_0_rd2]
set_property HDL_ATTRIBUTE.DEBUG true [get_bd_nets ID_0_rs11]
set_property HDL_ATTRIBUTE.MARK_DEBUG true [get_bd_nets ID_0_rs11]
set_property HDL_ATTRIBUTE.DEBUG true [get_bd_nets ID_0_rs12]
set_property HDL_ATTRIBUTE.MARK_DEBUG true [get_bd_nets ID_0_rs12]
set_property HDL_ATTRIBUTE.DEBUG true [get_bd_nets ID_0_rs21]
set_property HDL_ATTRIBUTE.MARK_DEBUG true [get_bd_nets ID_0_rs21]
set_property HDL_ATTRIBUTE.DEBUG true [get_bd_nets ID_0_rs22]
set_property HDL_ATTRIBUTE.MARK_DEBUG true [get_bd_nets ID_0_rs22]
set_property HDL_ATTRIBUTE.DEBUG true [get_bd_nets ID_RN_0_ID_RN_op_1]
set_property HDL_ATTRIBUTE.MARK_DEBUG true [get_bd_nets ID_RN_0_ID_RN_op_1]
set_property HDL_ATTRIBUTE.DEBUG true [get_bd_nets ID_RN_0_ID_RN_op_2]
set_property HDL_ATTRIBUTE.MARK_DEBUG true [get_bd_nets ID_RN_0_ID_RN_op_2]
set_property HDL_ATTRIBUTE.DEBUG true [get_bd_nets ID_RN_0_ID_RN_rd_1]
set_property HDL_ATTRIBUTE.MARK_DEBUG true [get_bd_nets ID_RN_0_ID_RN_rd_1]
set_property HDL_ATTRIBUTE.DEBUG true [get_bd_nets ID_RN_0_ID_RN_rs1_1]
set_property HDL_ATTRIBUTE.MARK_DEBUG true [get_bd_nets ID_RN_0_ID_RN_rs1_1]
set_property HDL_ATTRIBUTE.DEBUG true [get_bd_nets ID_RN_0_ID_RN_rs2_1]
set_property HDL_ATTRIBUTE.MARK_DEBUG true [get_bd_nets ID_RN_0_ID_RN_rs2_1]
set_property HDL_ATTRIBUTE.DEBUG true [get_bd_nets IF_0_PC1]
set_property HDL_ATTRIBUTE.MARK_DEBUG true [get_bd_nets IF_0_PC1]
set_property HDL_ATTRIBUTE.DEBUG true [get_bd_nets IF_0_PC2]
set_property HDL_ATTRIBUTE.MARK_DEBUG true [get_bd_nets IF_0_PC2]

validate_bd_design
save_bd_design
